# EAGLE schematic Synth_2 (EAGLE 9.5.2)
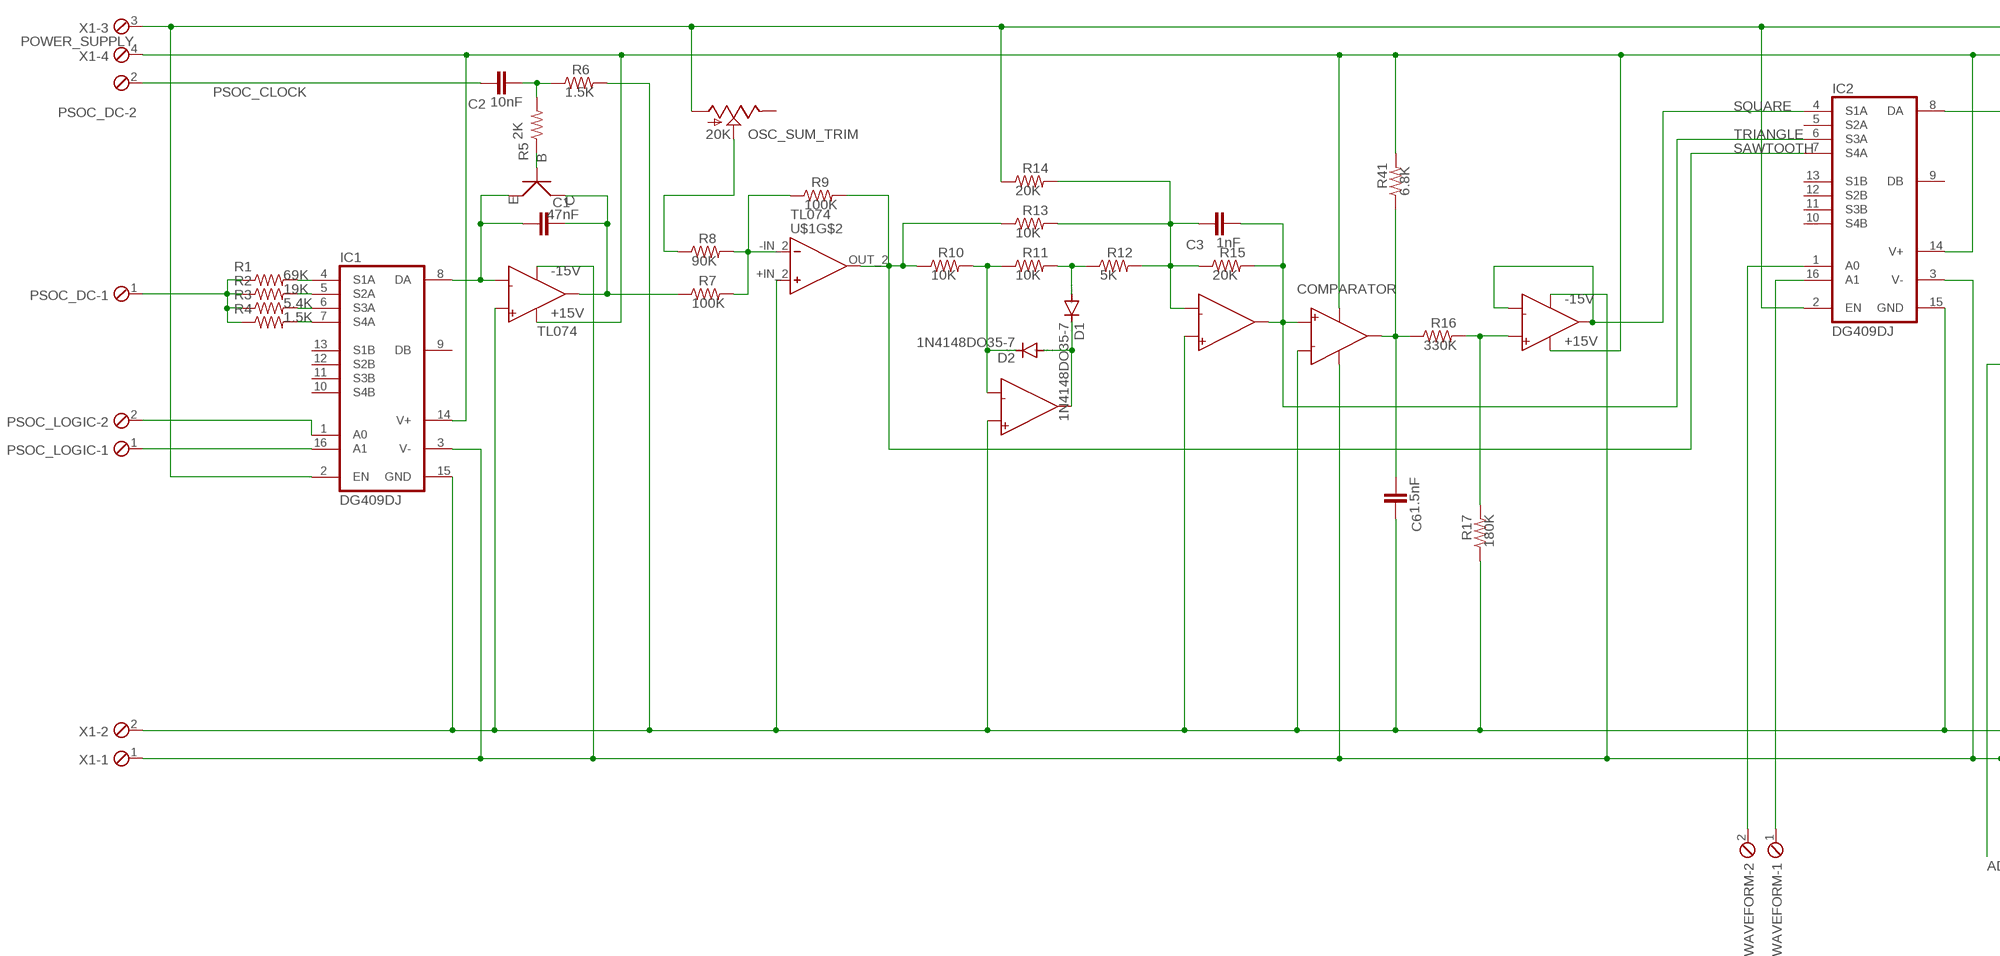
[diagram p0: schematic, sheet 1, part 1 of 2]
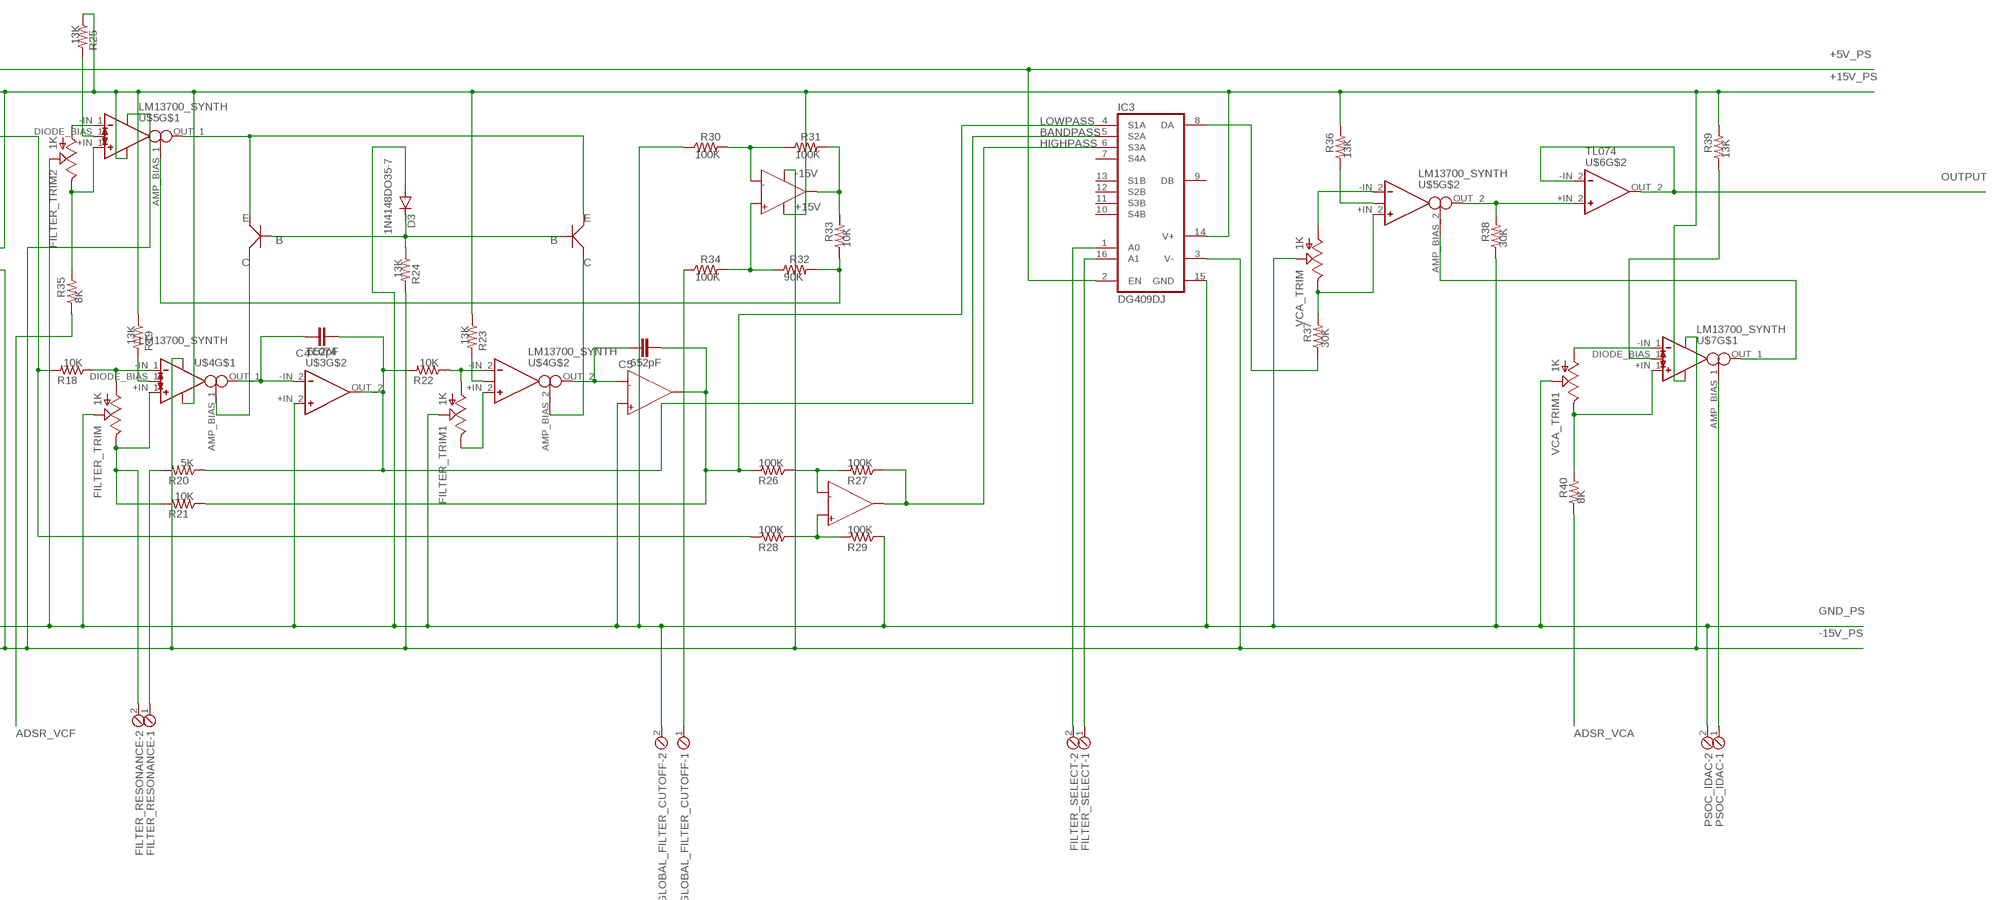
[diagram p1: schematic, sheet 1, part 2 of 2]

## Parts
C1  C-EU025-024X044  [C025-024X044]
C2  C-EU025-024X044  [C025-024X044]
C3  C-EU025-024X044  [C025-024X044]
C4  C-EU025-024X044  [C025-024X044]
C5  C-EU025-024X044  [C025-024X044]
C6  C-EU025-024X044  [C025-024X044]
D1  1N4148DO35-7  [DO35-7]
D2  1N4148DO35-7  [DO35-7]
D3  1N4148DO35-7  [DO35-7]
FILTER_RESONANCE  MPT2  [2POL254]
FILTER_SELECT  MPT2  [2POL254]
FILTER_TRIM  TRIM_US-CT6  [CT6]
FILTER_TRIM1  TRIM_US-CT6  [CT6]
FILTER_TRIM2  TRIM_US-CT6  [CT6]
GLOBAL_FILTER_CUTOFF  MPT2  [2POL254]
IC1  DG409DJ  [DIL16]
IC2  DG409DJ  [DIL16]
IC3  DG409DJ  [DIL16]
LM293  LM293  [LM293]
OSC_SUM_TRIM  TRIM_US-CT6  [CT6]
PSOC_DC  MPT2  [2POL254]
PSOC_IDAC  MPT2  [2POL254]
PSOC_LOGIC  MPT2  [2POL254]
R1  R-US_0204/7  [0204/7]
R2  R-US_0204/7  [0204/7]
R3  R-US_0204/7  [0204/7]
R4  R-US_0204/7  [0204/7]
R5  R-US_0204/7  [0204/7]
R6  R-US_0204/7  [0204/7]
R7  R-US_0204/7  [0204/7]
R8  R-US_0204/7  [0204/7]
R9  R-US_0204/7  [0204/7]
R10  R-US_0204/7  [0204/7]
R11  R-US_0204/7  [0204/7]
R12  R-US_0204/7  [0204/7]
R13  R-US_0204/7  [0204/7]
R14  R-US_0204/7  [0204/7]
R15  R-US_0204/7  [0204/7]
R16  R-US_0204/7  [0204/7]
R17  R-US_0204/7  [0204/7]
R18  R-US_0204/7  [0204/7]
R19  R-US_0204/7  [0204/7]
R20  R-US_0204/7  [0204/7]
R21  R-US_0204/7  [0204/7]
R22  R-US_0204/7  [0204/7]
R23  R-US_0204/7  [0204/7]
R24  R-US_0204/7  [0204/7]
R25  R-US_0204/7  [0204/7]
R26  R-US_0204/7  [0204/7]
R27  R-US_0204/7  [0204/7]
R28  R-US_0204/7  [0204/7]
R29  R-US_0204/7  [0204/7]
R30  R-US_0204/7  [0204/7]
R31  R-US_0204/7  [0204/7]
R32  R-US_0204/7  [0204/7]
R33  R-US_0204/7  [0204/7]
R34  R-US_0204/7  [0204/7]
R35  R-US_0204/7  [0204/7]
R36  R-US_0204/7  [0204/7]
R37  R-US_0204/7  [0204/7]
R38  R-US_0204/7  [0204/7]
R39  R-US_0204/7  [0204/7]
R40  R-US_0204/7  [0204/7]
R41  R-US_0204/7  [0204/7]
U$1  TL074  [TL074]
U$2  MPQ2907A  [MPQ2907A]
U$3  TL074  [TL074]
U$4  LM13700_SYNTH  [LM13700_SYNTH]
U$5  LM13700_SYNTH  [LM13700_SYNTH]
U$6  TL074  [TL074]
U$7  LM13700_SYNTH  [LM13700_SYNTH]
VCA_TRIM  TRIM_US-CT6  [CT6]
VCA_TRIM1  TRIM_US-CT6  [CT6]
WAVEFORM  MPT2  [2POL254]
X1  POWER_SUPPLY  MPT4  [4POL254]

## Nets
+5V_PS: IC1.2(EN) IC2.2(EN) IC3.2(EN) OSC_SUM_TRIM.A R14.1 X1.3
+15V_PS: IC1.14(V+) IC2.14(V+) IC3.14(V+) LM293.VCC R19.1 R23.1 R25.1 R36.2 R39.2 R41.2 U$1.VCC+ U$3.VCC+ U$4.+V U$5.+V U$6.VCC+ U$7.+V X1.4
-15V_PS: IC1.3(V-) IC2.3(V-) IC3.3(V-) LM293.GND R24.2 U$1.VCC- U$3.VCC- U$4.-V U$5.-V U$6.VCC- U$7.-V X1.1
ADSR_VCA: R40.2 U$7.+IN_1 VCA_TRIM1.E
ADSR_VCF: R35.1
BANDPASS: C4.2 IC3.5(S2A) R20.1 R22.2 U$3.OUT_2
COMPARATOR: C6.2 LM293.OUT_1 R16.1 R41.1
GND_PS: C6.1 D3.A FILTER_TRIM1.S FILTER_TRIM2.S FILTER_TRIM.S GLOBAL_FILTER_CUTOFF.2 IC1.15(GND) IC2.15(GND) IC3.15(GND) LM293.-IN_1 PSOC_IDAC.2 R6.2 R17.1 R29.1 R30.1 R38.1 U$1.+IN_1 U$1.+IN_2 U$1.+IN_3 U$1.+IN_4 U$3.+IN_2 U$3.+IN_4 VCA_TRIM1.S VCA_TRIM.S X1.2
HIGHPASS: IC3.6(S3A) R27.1 U$3.OUT_3
LOWPASS: C5.2 IC3.4(S1A) R21.1 R26.2 U$3.OUT_4
N$1: IC1.4(S1A) R1.2
N$2: IC1.5(S2A) R2.2
N$3: IC1.6(S3A) R3.2
N$4: IC1.7(S4A) R4.2
N$5: PSOC_DC.1 R1.1 R2.1 R3.1 R4.1
N$6: IC1.1(A0) PSOC_LOGIC.2
N$7: IC1.16(A1) PSOC_LOGIC.1
N$8: R5.1 U$2.Q1_B(B)
N$9: C2.2 R5.2 R6.1
N$10: C1.2 R7.1 U$1.OUT_1 U$2.Q1_C(C)
N$11: R7.2 R8.2 R9.1 U$1.-IN_2
N$12: D2.C R10.2 R11.1 U$1.-IN_3
N$13: IC2.16(A1) WAVEFORM.1
N$14: D1.A R11.2 R12.1
N$15: D1.C D2.A U$1.OUT_3
N$16: C3.1 R12.2 R13.2 R14.2 R15.1 U$1.-IN_4
N$17: IC2.1(A0) WAVEFORM.2
N$18: IC2.8(DA) R18.2 R28.2
N$19: R16.2 R17.2 U$3.+IN_1
N$20: FILTER_TRIM.A R18.1 U$4.-IN_1
N$21: FILTER_RESONANCE.2 FILTER_TRIM.E R21.2 U$4.+IN_1
N$22: R19.2 U$4.DIODE_BIAS_1
N$23: C4.1 U$3.-IN_2 U$4.OUT_1
N$24: U$2.Q3_C(C) U$4.AMP_BIAS_2
N$25: FILTER_TRIM1.A R22.1 U$4.-IN_2
N$26: U$2.Q2_C(C) U$4.AMP_BIAS_1
N$27: R23.2 U$4.DIODE_BIAS_2
N$28: C5.1 U$3.-IN_4 U$4.OUT_2
N$29: FILTER_TRIM1.E U$4.+IN_2
N$30: D3.C R24.1 U$2.Q2_B(B) U$2.Q3_B(B)
N$31: R26.1 R27.2 U$3.-IN_3
N$32: U$2.Q2_E(E) U$2.Q3_E(E) U$5.OUT_1
N$33: R30.2 R31.1 U$6.-IN_1
N$34: FILTER_TRIM2.E R35.2 U$5.+IN_1
N$35: FILTER_TRIM2.A U$5.-IN_1
N$36: R25.2 U$5.DIODE_BIAS_1
N$37: R28.1 R29.2 U$3.+IN_3
N$38: R31.2 R33.2 U$6.OUT_1
N$39: R32.1 R34.2 U$6.+IN_1
N$40: R32.2 R33.1 U$5.AMP_BIAS_1
N$41: FILTER_SELECT.1 IC3.16(A1)
N$42: FILTER_SELECT.2 IC3.1(A0)
N$43: R36.1 U$5.DIODE_BIAS_2
N$44: GLOBAL_FILTER_CUTOFF.1 R34.1
N$45: U$5.-IN_2 VCA_TRIM.A
N$46: R37.2 U$5.+IN_2 VCA_TRIM.E
N$47: U$5.AMP_BIAS_2 U$7.OUT_1
N$48: IC3.8(DA) R37.1
N$49: R38.2 U$5.OUT_2 U$6.+IN_2
N$50: R40.1
N$51: PSOC_IDAC.1 U$7.AMP_BIAS_1
N$52: R39.1 U$7.DIODE_BIAS_1
N$53: U$7.-IN_1 VCA_TRIM1.A
N$54: OSC_SUM_TRIM.S R8.1
N$55: FILTER_RESONANCE.1 R20.2
OUTPUT: U$6.-IN_2 U$6.OUT_2
PSOC_CLOCK: C2.1 PSOC_DC.2
SAWTOOTH: IC2.7(S4A) R9.2 R10.1 R13.1 U$1.OUT_2
SQUARE: IC2.4(S1A) U$3.-IN_1 U$3.OUT_1
TL074: C1.1 IC1.8(DA) U$1.-IN_1 U$2.Q1_E(E)
TRIANGLE: C3.2 IC2.6(S3A) LM293.+IN_1 R15.2 U$1.OUT_4
Unconnected: IC1.9(DB) IC1.10(S4B) IC1.11(S3B) IC1.12(S2B) IC1.13(S1B) IC2.5(S2A) IC2.9(DB) IC2.10(S4B) IC2.11(S3B) IC2.12(S2B) IC2.13(S1B) IC3.7(S4A) IC3.9(DB) IC3.10(S4B) IC3.11(S3B) IC3.12(S2B) IC3.13(S1B) LM293.+IN_2 LM293.-IN_2 LM293.OUT_2 OSC_SUM_TRIM.E U$2.Q4_B(B) U$2.Q4_C(C) U$2.Q4_E(E) U$4.BUFF_IN_1(BUFF_IN) U$4.BUFF_IN_2(BUFF_IN) U$4.BUFF_OUT_1(BUFF_OUT) U$4.BUFF_OUT_2(BUFF_OUT) U$5.BUFF_IN_1(BUFF_IN) U$5.BUFF_IN_2(BUFF_IN) U$5.BUFF_OUT_1(BUFF_OUT) U$5.BUFF_OUT_2(BUFF_OUT) U$6.+IN_3 U$6.+IN_4 U$6.-IN_3 U$6.-IN_4 U$6.OUT_3 U$6.OUT_4 U$7.+IN_2 U$7.-IN_2 U$7.AMP_BIAS_2 U$7.BUFF_IN_1(BUFF_IN) U$7.BUFF_IN_2(BUFF_IN) U$7.BUFF_OUT_1(BUFF_OUT) U$7.BUFF_OUT_2(BUFF_OUT) U$7.DIODE_BIAS_2 U$7.OUT_2

## Library data of the parts
C1 = rcl:C-EU: CAPACITOR, European symbol; SPICEPREFIX: 47nF
C2 = rcl:C-EU: CAPACITOR, European symbol; SPICEPREFIX: 10nF
C3 = rcl:C-EU: CAPACITOR, European symbol; SPICEPREFIX: 1nF
C4 C5 = rcl:C-EU: CAPACITOR, European symbol; SPICEPREFIX: 652pF
C6 = rcl:C-EU: CAPACITOR, European symbol; SPICEPREFIX: 1.5nF
D1-D3 = diode:1N4148: DIODE high speed (Philips)
FILTER_RESONANCE FILTER_SELECT GLOBAL_FILTER_CUTOFF PSOC_DC PSOC_IDAC PSOC_LOGIC WAVEFORM = con-phoenix-254:MPT2: PHOENIX CONNECTOR; OC_FARNELL: unknown; OC_NEWARK: unknown
FILTER_TRIM FILTER_TRIM1 FILTER_TRIM2 OSC_SUM_TRIM VCA_TRIM VCA_TRIM1 = pot:TRIM_US-: POTENTIOMETER
IC1-IC3 = maxim:DG409DJ: ANALOG MULTIPLEXER; MF: INTERSIL; MPN: DG409DJ; OC_FARNELL: 9664084; OC_NEWARK: 06F3963
LM293 = LM13700:LM293
R1 = rcl:R-US_: RESISTOR, American symbol; SPICEPREFIX: 69K
R2 = rcl:R-US_: RESISTOR, American symbol; SPICEPREFIX: 19K
R3 = rcl:R-US_: RESISTOR, American symbol; SPICEPREFIX: 5.4K
R4 R6 = rcl:R-US_: RESISTOR, American symbol; SPICEPREFIX: 1.5K
R5 = rcl:R-US_: RESISTOR, American symbol; SPICEPREFIX: 2K
R7 R9 R26-R31 R34 = rcl:R-US_: RESISTOR, American symbol; SPICEPREFIX: 100K
R8 R32 = rcl:R-US_: RESISTOR, American symbol; SPICEPREFIX: 90K
R10 R11 R13 R18 R21 R22 R33 = rcl:R-US_: RESISTOR, American symbol; SPICEPREFIX: 10K
R12 R20 = rcl:R-US_: RESISTOR, American symbol; SPICEPREFIX: 5K
R14 R15 = rcl:R-US_: RESISTOR, American symbol; SPICEPREFIX: 20K
R16 = rcl:R-US_: RESISTOR, American symbol; SPICEPREFIX: 330K
R17 = rcl:R-US_: RESISTOR, American symbol; SPICEPREFIX: 180K
R19 R23-R25 R36 R39 = rcl:R-US_: RESISTOR, American symbol; SPICEPREFIX: 13K
R35 R40 = rcl:R-US_: RESISTOR, American symbol; SPICEPREFIX: 8K
R37 R38 = rcl:R-US_: RESISTOR, American symbol; SPICEPREFIX: 30K
R41 = rcl:R-US_: RESISTOR, American symbol; SPICEPREFIX: 6.8K
U$1 U$3 U$6 = LM13700:TL074
U$2 = LM13700:MPQ2907A
U$4 U$5 U$7 = LM13700:LM13700_SYNTH
X1 = con-phoenix-254:MPT4: PHOENIX CONNECTOR; OC_FARNELL: unknown; OC_NEWARK: unknown